# EAGLE design alcoholsensor (EAGLE 8.1.0)
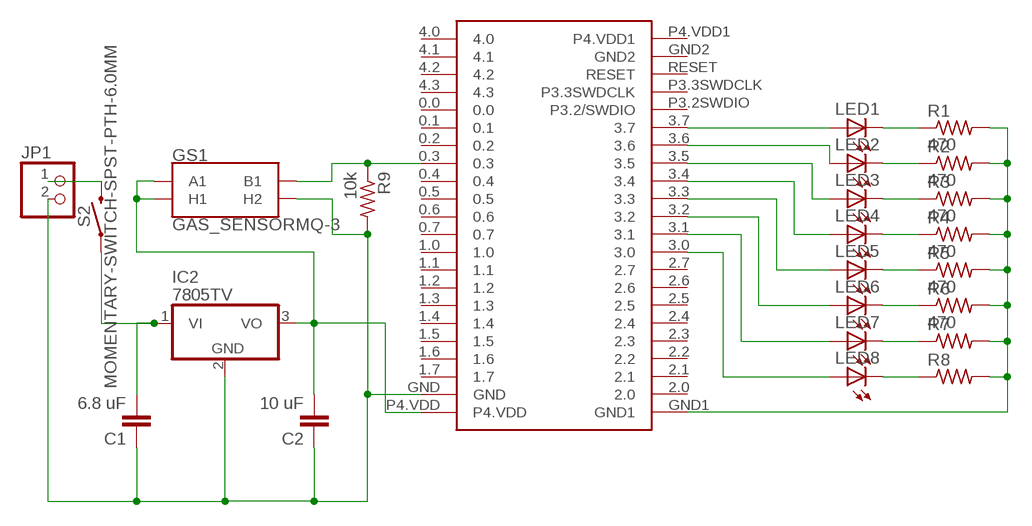
[diagram p0: schematic, sheet 1]

## Parts
C1  6.8 uF  C2.5/4  [C2.5-4]
C2  10 uF  C2.5/4  [C2.5-4]
GS1  GAS_SENSORMQ-3  [GAS_SENSOR]
IC2  7805TV  [TO220V]
JP1  PINHD-1X2  [1X02]
LED1  LED5MM  [LED5MM]
LED2  LED5MM  [LED5MM]
LED3  LED5MM  [LED5MM]
LED4  LED5MM  [LED5MM]
LED5  LED5MM  [LED5MM]
LED6  LED5MM  [LED5MM]
LED7  LED5MM  [LED5MM]
LED8  LED5MM  [LED5MM]
R1  470  R-US_0207/10  [0207/10]
R2  470  R-US_0207/10  [0207/10]
R3  470  R-US_0207/10  [0207/10]
R4  470  R-US_0207/10  [0207/10]
R5  470  R-US_0207/10  [0207/10]
R6  470  R-US_0207/10  [0207/10]
R7  R-US_0207/10  [0207/10]
R8  R-US_0207/10  [0207/10]
R9  10k  R-US_0207/10  [0207/10]
S2  MOMENTARY-SWITCH-SPST-PTH-6.0MM  [TACTILE_SWITCH_PTH_6.0MM]
U$1  CY8CKIT-049  [CY8CKIT-049]

## Nets
5V: C2.2 GS1.A1 GS1.HA(H1) IC2.3(VO) U$1.P4.VDD
6V: C1.2 IC2.1(VI) S2.1
BLUE: LED7.A U$1.3.1
BLUE1: LED8.A U$1.3.0
DATA: GS1.B1 R9.1 U$1.0.3
GND1: C1.1 C2.1 GS1.HB(H2) IC2.2(GND) JP1.2 R9.2 U$1.GND
GND2: R1.2 R2.2 R3.2 R4.2 R5.2 R6.2 R7.2 R8.2 U$1.GND1
GREEN: LED5.A U$1.3.3
GREEN1: LED6.A U$1.3.2
N$1: JP1.1 S2.3
N$9: LED1.K(C) R1.1
N$10: LED2.K(C) R2.1
N$11: LED3.K(C) R3.1
N$12: LED4.K(C) R4.1
N$13: LED5.K(C) R5.1
N$14: LED6.K(C) R6.1
N$15: LED7.K(C) R7.1
N$16: LED8.K(C) R8.1
ORANGE: LED3.A U$1.3.5
ORANGE1: LED4.A U$1.3.4
RED: LED1.A U$1.3.7
RED1: LED2.A U$1.3.6
Unconnected: U$1.0.0 U$1.0.1 U$1.0.2 U$1.0.4 U$1.0.5 U$1.0.6 U$1.0.7 U$1.1.0 U$1.1.1 U$1.1.2 U$1.1.3 U$1.1.4 U$1.1.5 U$1.1.6 U$1.1.7 U$1.2.0 U$1.2.1 U$1.2.2 U$1.2.3 U$1.2.4 U$1.2.5 U$1.2.6 U$1.2.7 U$1.4.0 U$1.4.1 U$1.4.2 U$1.4.3 U$1.GND2 U$1.P3.2SWDIO(P3.2/SWDIO) U$1.P3.3SWDCLK U$1.P4.VDD1 U$1.RESET

## Library data of the parts
C1 C2 = capacitor-wima:C: CAPACITOR naming: grid - package width
GS1 = SparkFun-Sensors:GAS_SENSOR: Gas Sensors - MQ-3, MQ-4, MQ-6, MQ-7, MQ-8 Through-hole gas sensors with a heating coil and an analog output. Example Datasheet <https://cdn.sparkfun.com/datasheets/Sensors/Biometric/MQ-3%20ver1.3%20-%20Manual.pdf> SparkFun Products Gas Sensor Breakout Board <https://www.sparkfun.com/products/8891> (BOB-8891) - Breakout board compatible with all gas sensors. Alcohol Gas Sensor - MQ-3 <https://www.sparkfun.com/products/8880> (SEN-08880) Methane CNG Gas Sensor - MQ-4 <https://www.sparkfun.com/products/9404> (SEN-09404) LPG Gas Sensor - MQ-6 <https://www.sparkfun.com/products/9405> (SEN-09405) Carbon Monoxide Sensor - MQ-7 <https://www.sparkfun.com/products/9403> (SEN-09403) Hydrogen Gas Sensor - MQ-8 <https://www.sparkfun.com/products/10916> (SEN-10916); PROD_ID: COMP-12216; SF_ID: SEN-08880
IC2 = linear:78*: Positive VOLTAGE REGULATOR Source: http://cache.national.com/ds/LM/LM78L05.pdf http://www.fairchildsemi.com/ds/LM/LM7805.pdf
JP1 = pinhead:PINHD-1X2: PIN HEADER
LED1-LED8 = led:LED: LED OSRAM: - CHIPLED LG R971, LG N971, LY N971, LG Q971, LY Q971, LO R971, LY R971 LH N974, LH R974 LS Q976, LO Q976, LY Q976 LO Q996 - Hyper CHIPLED LW Q18S LB Q993, LB Q99A, LB R99A - SideLED LS A670, LO A670, LY A670, LG A670, LP A670 LB A673, LV A673, LT A673, LW A673 LH A674 LY A675 LS A676, LA A676, LO A676, LY A676, LW A676 LS A679, LY A679, LG A679 - Hyper Micro SIDELED® LS Y876, LA Y876, LO Y876, LY Y876 LT Y87S - SmartLED LW L88C, LW L88S LB L89C, LB L89S, LG L890 LS L89K, LO L89K, LY L89K LS L896, LA L896, LO L896, LY L896 - TOPLED LS T670, LO T670, LY T670, LG T670, LP T670 LSG T670, LSP T670, LSY T670, LOP T670, LYG T670 LG T671, LOG T671, LSG T671 LB T673, LV T673, LT T673, LW T673 LH T674 LS T676, LA T676, LO T676, LY T676, LB T676, LH T676, LSB T676, LW T676 LB T67C, LV T67C, LT T67C, LS T67K, LO T67K, LY T67K, LW E67C LS E67B, LA E67B, LO E67B, LY E67B, LB E67C, LV E67C, LT E67C LW T67C LS T679, LY T679, LG T679 LS T770, LO T770, LY T770, LG T770, LP T770 LB T773, LV T773, LT T773, LW T773 LH T774 LS E675, LA E675, LY E675, LS T675 LS T776, LA T776, LO T776, LY T776, LB T776 LHGB T686 LT T68C, LB T68C - Hyper Mini TOPLED® LB M676 - Mini TOPLED Santana® LG M470 LS M47K, LO M47K, LY M47K Source: http://www.osram.convergy.de LUXEON: - LUMILED® LXK2-PW12-R00, LXK2-PW12-S00, LXK2-PW14-U00, LXK2-PW14-V00 LXK2-PM12-R00, LXK2-PM12-S00, LXK2-PM14-U00 LXK2-PE12-Q00, LXK2-PE12-R00, LXK2-PE12-S00, LXK2-PE14-T00, LXK2-PE14-U00 LXK2-PB12-K00, LXK2-PB12-L00, LXK2-PB12-M00, LXK2-PB14-N00, LXK2-PB14-P00, LXK2-PB14-Q00 LXK2-PR12-L00, LXK2-PR12-M00, LXK2-PR14-Q00, LXK2-PR14-R00 LXK2-PD12-Q00, LXK2-PD12-R00, LXK2-PD12-S00 LXK2-PH12-R00, LXK2-PH12-S00 LXK2-PL12-P00, LXK2-PL12-Q00, LXK2-PL12-R00 Source: www.luxeon.com KINGBRIGHT: KA-3528ASYC Source: www.kingbright.com
R1-R9 = rcl:R-US_: RESISTOR, American symbol
S2 = SparkFun-Switches:MOMENTARY-SWITCH-SPST: Momentary Switch (Pushbutton) - SPST Normally-open (NO) SPST momentary switches (buttons, pushbuttons). Variants PTH-12MM - 12mm square, through-hole Momentary Pushbutton Switch - 12mm Square <https://www.sparkfun.com/products/9190> (COM-09190) PTH-6.0MM, PTH-6.0MM-KIT - 6.0mm square, through-hole Mini Pushbutton Switch <https://www.sparkfun.com/products/97> (COM-00097) KIT package intended for soldering kit's - only one side of pads' copper is exposed. PTH-RIGHT-ANGLE-KIT - Right-angle, through-hole Right Angle Tactile Button <https://www.sparkfun.com/products/10791> - Used on SparkFun BigTime Watch Kit <https://www.sparkfun.com/products/11734> SMD-12MM - 12mm square, surface-mount Tactile Button - SMD (12mm) <https://www.sparkfun.com/products/12993> (COM-12993) Used on SparkFun PicoBoard <https://www.sparkfun.com/products/11888> SMD-4.5MM - 4.5mm Square Trackball Switch Used on SparkFun Blackberry Trackballer Breakout <https://www.sparkfun.com/products/13169> SMD-4.6MMX2.8MM - 4.60mm x 2.80mm, surface mount Used on SparkFun SAMD21 Mini Breakout <https://www.sparkfun.com/products/13664> SMD-5.2MM, SMD-5.2-REDUNDANT - 5.2mm square, surface-mount Mini Pushbutton Switch - SMD <https://www.sparkfun.com/products/8720> (COM-08720) Used on Arduino Pro Mini <https://www.sparkfun.com/products/11114> REDUNDANT package connects both switch circuits together SMD-6.0X3.5MM - 6.0 x 3.5mm, surface mount Momentary Reset Switch SMD <https://www.sparkfun.com/products/8229> (COM-08229) SMD-6.2MM-TALL - 6.2mm square, surface mount Tactile Button - SMD (6mm) <https://www.sparkfun.com/products/12992> Used on SparkFun Digital Sandbox <https://www.sparkfun.com/products/12651> SMD-RIGHT-ANGLE - Right-angle, surface mount Used on SparkFun Block for Intel® Edison - Arduino <https://www.sparkfun.com/products/13036>; PROD_ID: SWCH-08441; SF_SKU: COM-00097
U$1 = cypress:CY8CKIT-049

## Board
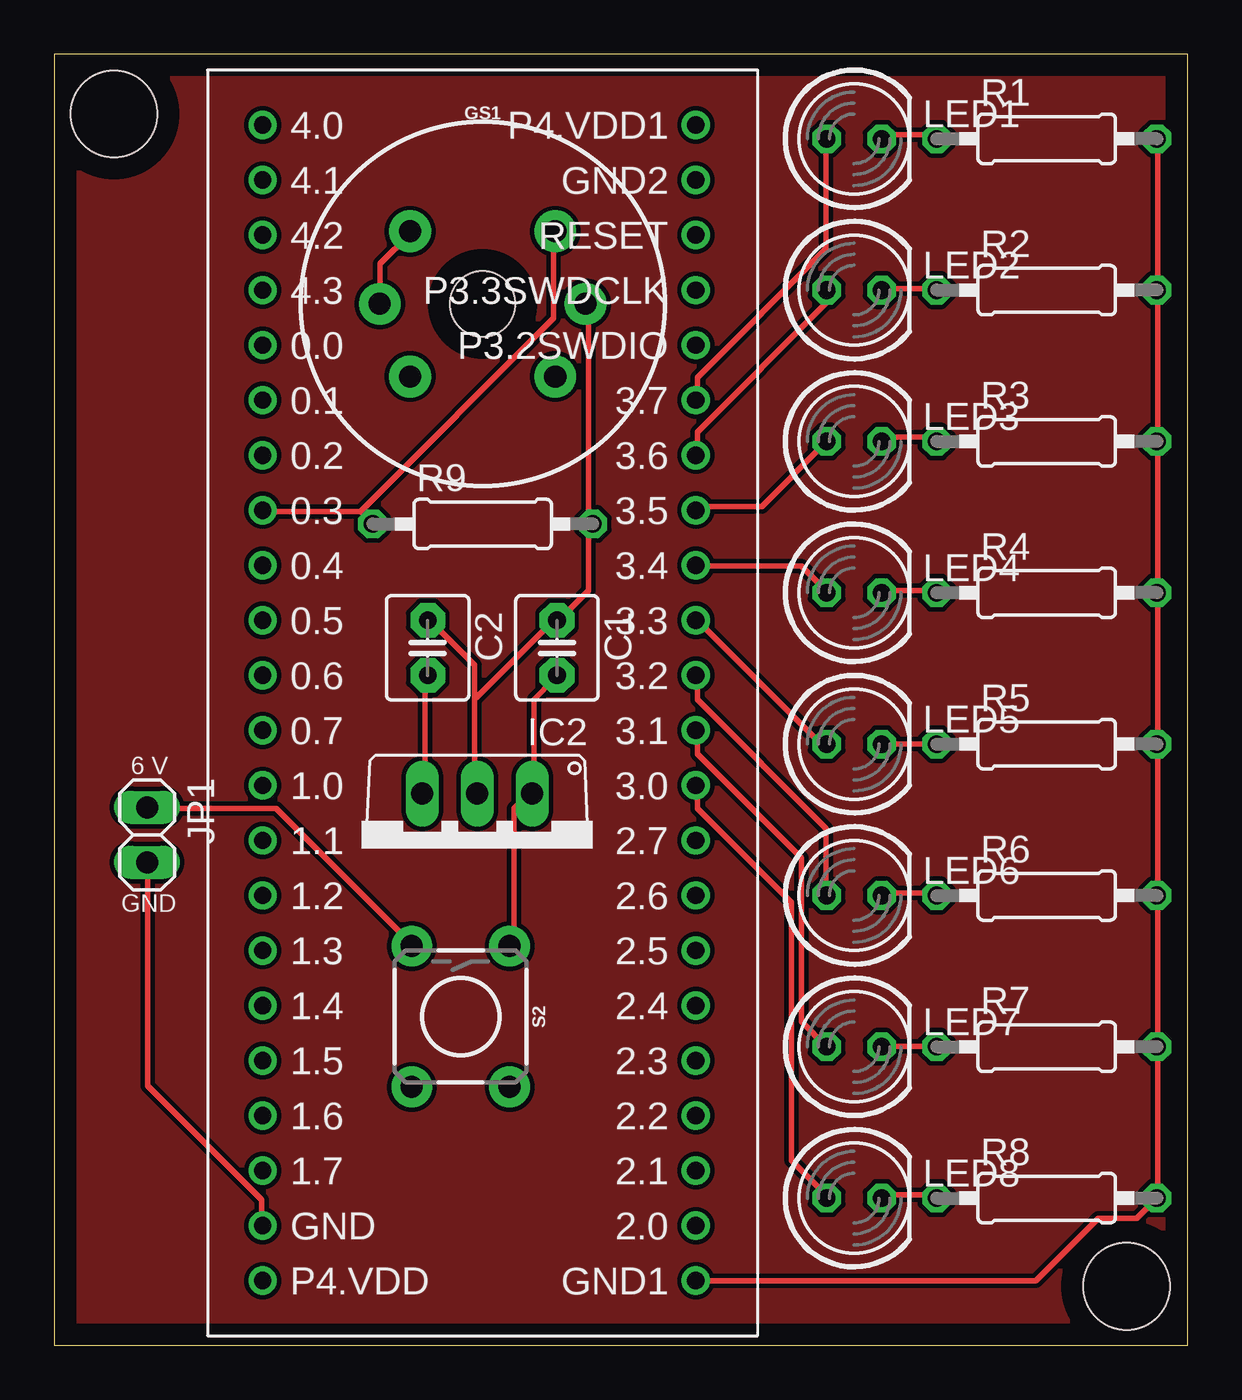
[diagram p1: board, top side]
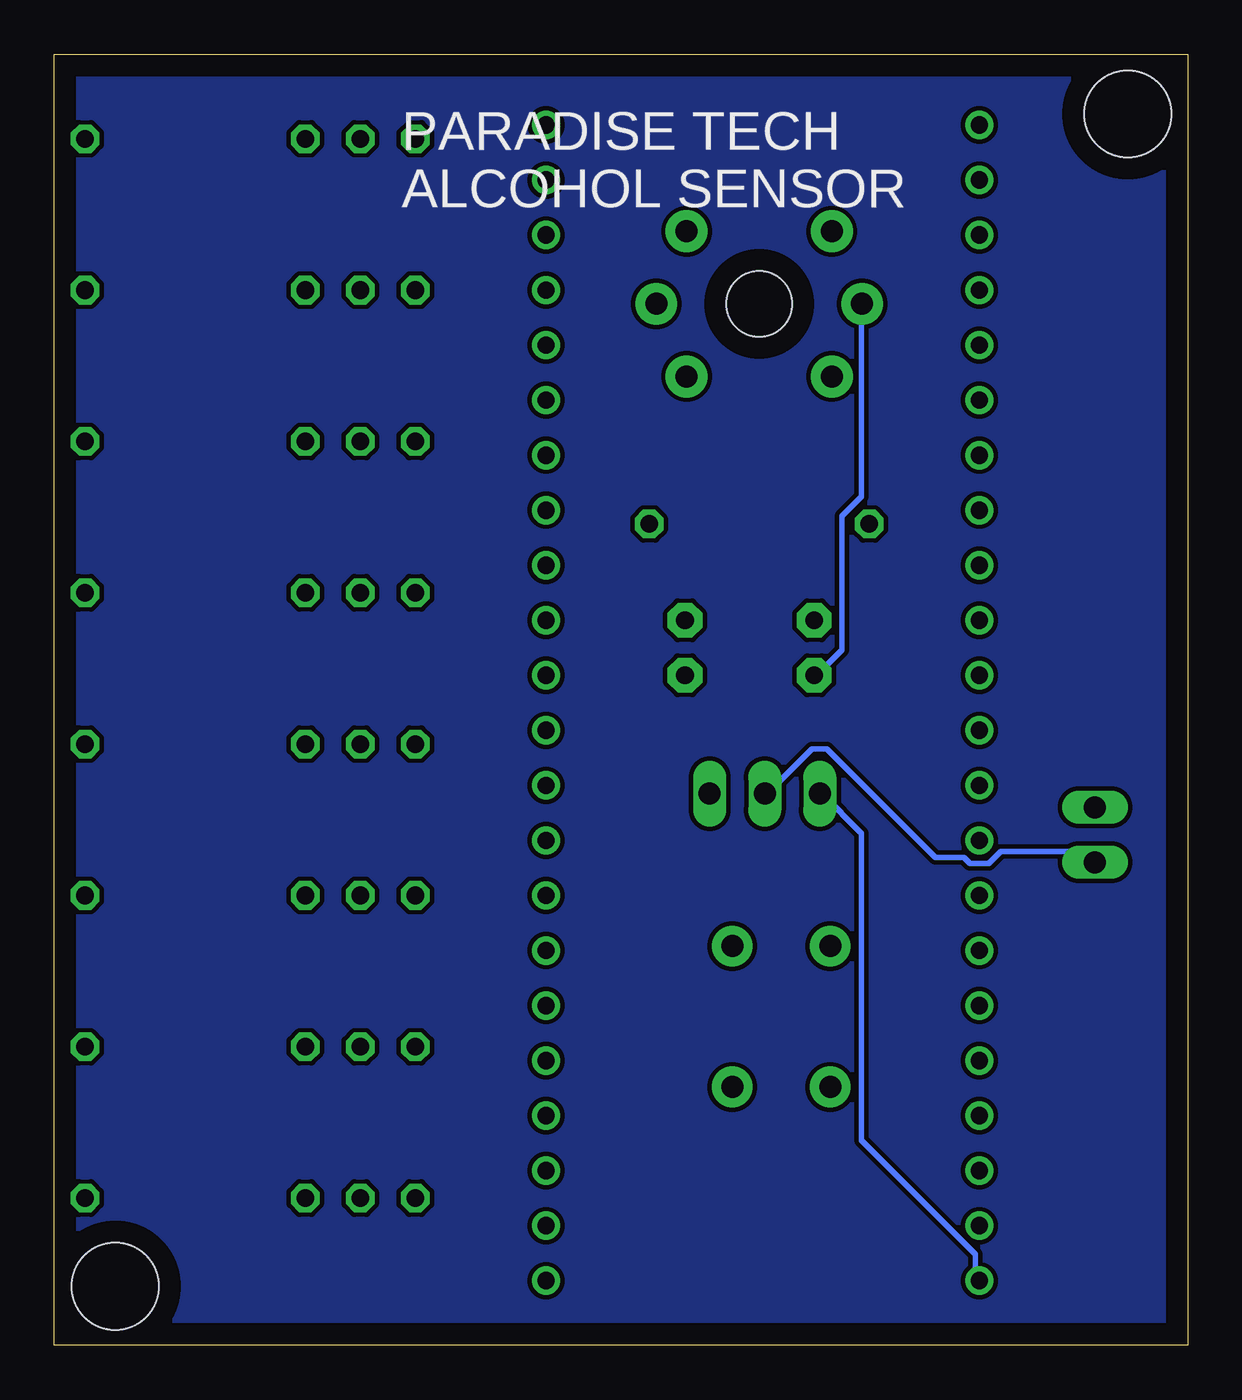
[diagram p2: board, bottom side, seen from below]

Size 52.32 x 59.59 mm. Coordinates in mm from the lower left corner, seen from the top.
Outline: 0,0 52.32,0 52.32,59.59 0,59.59 0,0
Copper layers (1*16): Top 0.035mm / dielectric 1.5mm / Bottom 0.035mm
Design rules "default": minimum track width 10mil, minimum drill 24mil, track to track 8mil, track to pad 8mil, pad to pad 8mil, via to via 8mil, smd to smd 8mil, copper to edge 40mil, drill to drill 8mil, minimum pad ring 10mil, minimum via ring 8mil, stop-mask expansion 4mil, vias tented up to drill 0mil, thermal gap 10mil
Holes 4 mm at 2.76,56.83 49.5,2.73

### Footprints (pad centres in the part's own frame; a part is rotated, then mirrored left to right if it is on the bottom)
C2.5-4 = drill 0.813 pad 1.6 octagon: 1 -1.27,0; 2 1.27,0
GAS_SENSOR = drill 1.016 pad 1.93: A1 -3.35,3.35; A2 -3.35,-3.35; B1 3.35,3.35; B2 3.35,-3.35; HA -4.75,0; HB 4.75,0 | hole 3: 0,0
TO220V = drill 1.016 long: 1 -2.54,-2.54; 2 0,-2.54; 3 2.54,-2.54
1X02 = drill 1.016 long: 1 -1.27,0; 2 1.27,0
LED5MM = drill 0.813 octagon: A -1.27,0; K 1.27,0
0207/10 = drill 0.813 octagon: 1 -5.08,0; 2 5.08,0
TACTILE_SWITCH_PTH_6.0MM = drill 1.016 pad 1.88: 1 -3.251,2.261; 2 3.251,2.261; 3 -3.251,-2.261; 4 3.251,-2.261
CY8CKIT-049 = drill 0.8 pad 1.016: 0.0 0,-5.08; 0.1 0,-7.62; 0.2 0,-10.16; 0.3 0,-12.7; 0.4 0,-15.24; 0.5 0,-17.78; 0.6 0,-20.32; 0.7 0,-22.86; 1.0 0,-25.4; 1.1 0,-27.94; 1.2 0,-30.48; 1.3 0,-33.02; 1.4 0,-35.56; 1.5 0,-38.1; 1.6 0,-40.64; 1.7 0,-43.18; 2.0 20,-45.72; 2.1 20,-43.18; 2.2 20,-40.64; 2.3 20,-38.1; 2.4 20,-35.56; 2.5 20,-33.02; 2.6 20,-30.48; 2.7 20,-27.94; 3.0 20,-25.4; 3.1 20,-22.86; 3.2 20,-20.32; 3.3 20,-17.78; 3.4 20,-15.24; 3.5 20,-12.7; 3.6 20,-10.16; 3.7 20,-7.62; 4.0 0,5.08; 4.1 0,2.54; 4.2 0,0; 4.3 0,-2.54; GND 0,-45.72; GND1 20,-48.26; GND2 20,2.54; P3.2SWDIO 20,-5.08; P3.3SWDCLK 20,-2.54; P4.VDD 0,-48.26; P4.VDD1 20,5.08; RESET 20,0

### Placement (x,y rotation side)
C1  23.21,32.19 270 top
C2  17.24,32.19 270 top
GS1  19.78,48.07 0 top
IC2  19.53,22.92 180 top
JP1  4.29,23.56 270 top
LED1  36.93,55.69 0 top
LED2  36.93,48.7 0 top
LED3  36.93,41.72 0 top
LED4  36.93,34.73 0 top
LED5  36.93,27.75 0 top
LED6  36.93,20.76 0 top
LED7  36.93,13.78 0 top
LED8  36.93,6.79 0 top
R1  45.82,55.69 0 top
R2  45.82,48.7 0 top
R3  45.82,41.72 0 top
R4  45.82,34.73 0 top
R5  45.82,27.75 0 top
R6  45.82,20.76 0 top
R7  45.82,13.78 0 top
R8  45.82,6.79 0 top
R9  19.78,37.91 0 top
S2  18.76,15.18 270 top
U$1  9.62,51.24 0 top

### Tracks (layer width: path | path; a pad name or v marks a point on that pad's centre or on a via)
5V
  Top 0.254: GS1.HA 15.06,48.09 15.06,49.92 16.43,51.3 GS1.A1 | C2.2 17.11,30.72 17.11,25.46 IC2.3
  Bottom 0.254: U$1.P4.VDD 9.8,3.06 9.8,4.2 15.06,9.46 15.06,23.63 16.88,25.46 IC2.3 | GS1.HA 15.06,47.87 15.06,39.18 15.97,38.27 15.97,32.09 17.11,30.95 C2.2
6V
  Top 0.254: C1.2 23.06,30.72 22.14,29.81 22.14,25.46 IC2.1 21.91,25.46 21.23,24.78 21.23,18.61 S2.1
BLUE
  Top 0.254: LED7.A 34.49,14.95 34.49,22.49 29.69,27.29 29.69,28.21 U$1.3.1
BLUE1
  Top 0.254: U$1.3.0 29.69,25.69 29.69,24.78 34.03,20.43 34.03,8.55 35.63,6.95 LED8.A
DATA
  Top 0.254: 14.14,38.49 9.8,38.49 U$1.0.3 | 14.14,38.49 14.6,38.04 R9.1 | 14.14,38.49 23.06,47.41 23.06,51.3 GS1.B1
GND1
  Top 0.254: U$1.GND 9.57,5.58 9.57,6.72 4.31,11.98 4.31,22.26 JP1.2 | 19.4,29.91 19.4,31.41 17.34,33.46 C2.1 | 19.4,29.91 19.4,25.46 IC2.2 | GS1.HB 24.66,47.87 24.66,38.04 R9.2 24.66,37.81 24.66,34.84 23.29,33.46 C1.1 23.06,33.46 19.5,29.91 19.4,29.91
  Bottom 0.254: 4.31,22.26 JP1.2 4.79,22.8 8.63,22.8 9.18,22.24 10.06,22.24 10.33,22.52 11.65,22.52 16.66,27.52 17.34,27.52 19.4,25.46 IC2.2
GND2
  Top 0.254: R1.2 50.95,55.64 50.95,48.78 R2.2 50.95,48.55 50.95,41.92 R3.2 50.95,41.69 50.95,34.84 R4.2 50.95,34.61 50.95,27.75 | 50.95,27.75 50.95,20.89 R6.2 50.95,20.66 50.95,13.8 R7.2 50.95,13.58 50.95,6.95 R8.2 49.97,5.87 48.2,5.87 45.31,2.98 U$1.GND1 | 50.95,27.75 R5.2
GREEN
  Top 0.254: LED5.A 35.4,27.75 29.69,33.46 U$1.3.3
GREEN1
  Top 0.254: U$1.3.2 29.69,30.72 29.69,29.81 35.63,23.86 35.63,20.89 LED6.A
N$1
  Top 0.254: JP1.1 4.31,24.78 10.26,24.78 16.43,18.61 S2.3
N$2
  pour Top: -0.03,59.63 52.29,59.63 52.29,58.61 52.29,-0.06 -0.03,-0.06
N$3
  pour Bottom (isolate 0.012): -0.03,59.63 52.29,59.63 52.29,-0.06 -0.03,-0.06 -0.03,0.19
N$9
  Top 0.254: LED1.K 38.37,55.87 40.66,55.87 R1.1
N$10
  Top 0.254: LED2.K 38.37,48.78 40.66,48.78 R2.1
N$11
  Top 0.254: LED3.K 38.37,41.92 40.66,41.92 R3.1
N$12
  Top 0.254: LED4.K 38.37,34.84 40.66,34.84 R4.1
N$13
  Top 0.254: R5.1 LED5.K
N$14
  Top 0.254: LED6.K 38.37,20.89 40.66,20.89 R6.1
N$15
  Top 0.254: LED7.K 38.37,13.8 40.66,13.8 R7.1
N$16
  Top 0.254: LED8.K 38.37,6.95 40.66,6.95 R8.1
ORANGE
  Top 0.254: LED3.A 32.66,38.72 29.69,38.72 U$1.3.5
ORANGE1
  Top 0.254: U$1.3.4 29.69,35.98 34.49,35.98 35.63,34.84 LED4.A
RED
  Top 0.254: U$1.3.7 29.69,43.75 29.69,44.67 35.63,50.61 35.63,55.64 LED1.A
RED1
  Top 0.254: U$1.3.6 29.69,41.24 29.69,42.15 35.63,48.09 35.63,48.55 LED2.A

### Text on the board
tPlace: 6 V | GND
bPlace: PARADISE TECH / ALCOHOL SENSOR